# Altium schematic sheet RegisterB.SchDoc: B Register
size A4; Author: Ben Eater; DrawnBy: LittleYe233; SheetNumber: 3; SheetTotal: 6
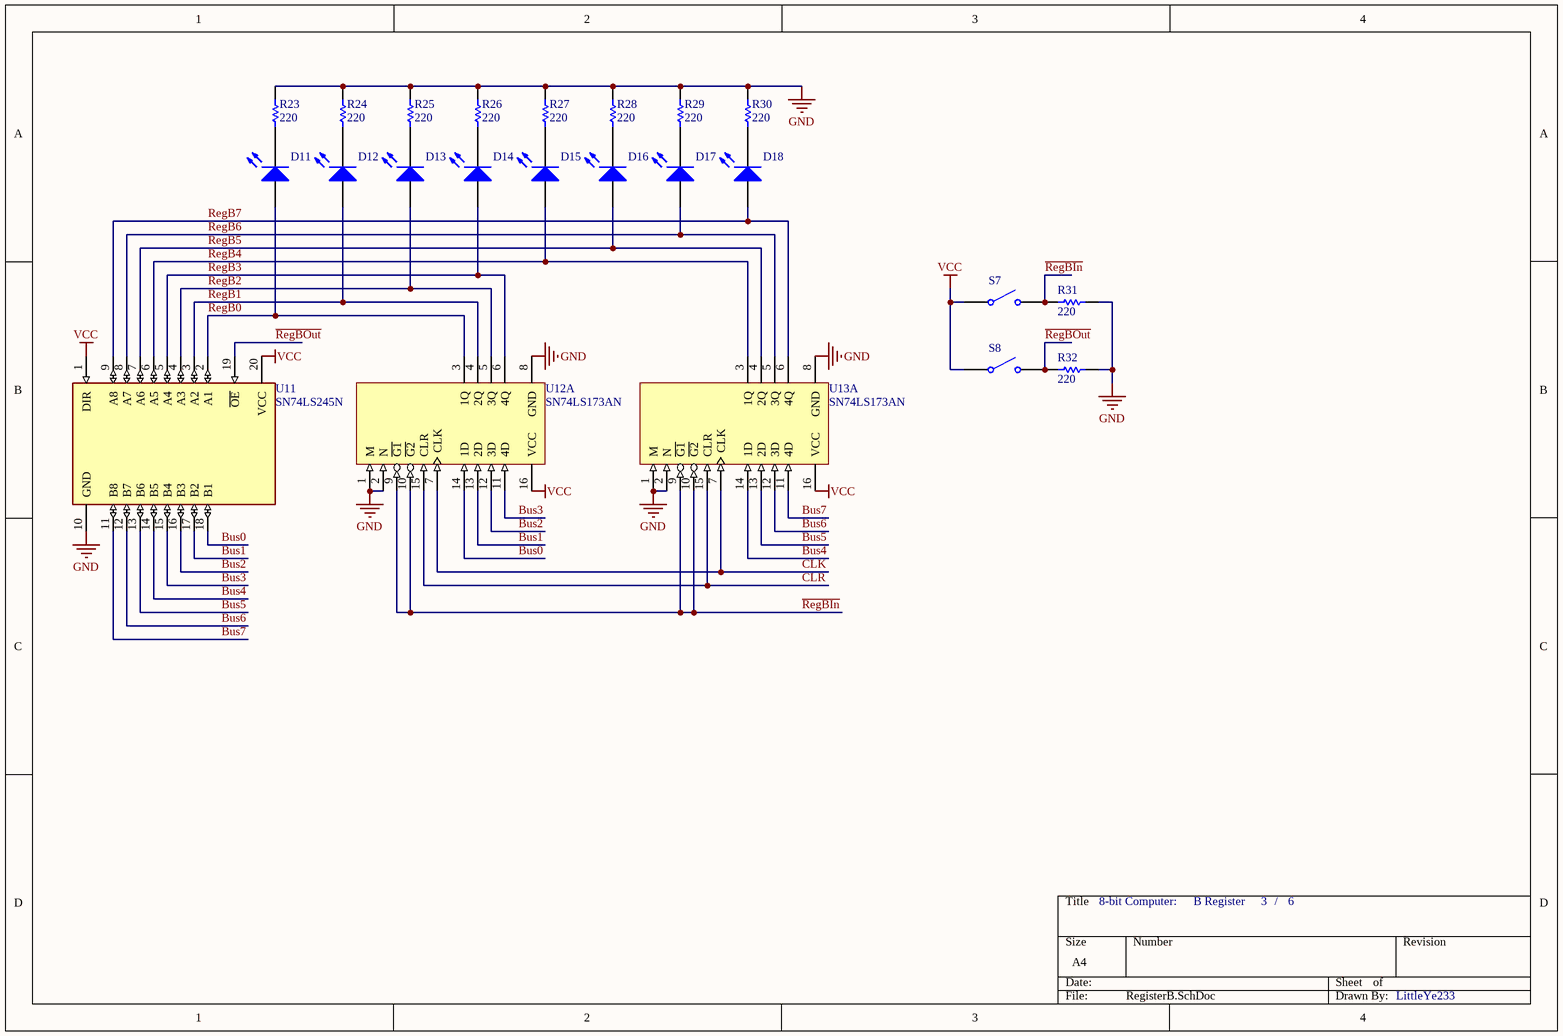
[diagram p0: RegisterB.SchDoc]

## Parts
D11  Light-Emitting Diode  (value not drawn)
D12  Light-Emitting Diode  (value not drawn)
D13  Light-Emitting Diode  (value not drawn)
D14  Light-Emitting Diode  (value not drawn)
D15  Light-Emitting Diode  (value not drawn)
D16  Light-Emitting Diode  (value not drawn)
D17  Light-Emitting Diode  (value not drawn)
D18  Light-Emitting Diode  (value not drawn)
R23  value 220  (hidden comment: Resistor)
R24  value 220  (hidden comment: Resistor)
R25  value 220  (hidden comment: Resistor)
R26  value 220  (hidden comment: Resistor)
R27  value 220  (hidden comment: Resistor)
R28  value 220  (hidden comment: Resistor)
R29  value 220  (hidden comment: Resistor)
R30  value 220  (hidden comment: Resistor)
R31  value 220  (hidden comment: Resistor)
R32  value 220  (hidden comment: Resistor)
S7  Single-Pole, Single-Throw Switch  (value not drawn)
S8  Single-Pole, Single-Throw Switch  (value not drawn)
U11  SN74LS245N  [FP-N0020A-MFG]
U12  SN74LS173AN  [N0016A]  (part A of 2)
U13  SN74LS173AN  [N0016A]  (part A of 2)

## Nets
GND: R23.2 R24.2 R25.2 R26.2 R27.2 R28.2 R29.2 R30.2 R31.1 R32.1 U11.10(GND) U12.1(M) U12.2(N) U12.8(GND) U13.1(M) U13.2(N) U13.8(GND)
VCC: S7.1 S8.1 U11.1(DIR) U11.20(VCC) U12.16(VCC) U13.16(VCC)
Bus0: U11.18(B1) U12.14(1D)
Bus1: U11.17(B2) U12.13(2D)
Bus2: U11.16(B3) U12.12(3D)
Bus3: U11.15(B4) U12.11(4D)
Bus4: U11.14(B5) U13.14(1D)
Bus5: U11.13(B6) U13.13(2D)
Bus6: U11.12(B7) U13.12(3D)
Bus7: U11.11(B8) U13.11(4D)
CLK: U12.7(CLK) U13.7(CLK)
CLR: U12.15(CLR) U13.15(CLR)
~{RegBIn}: R31.2 S7.2 U12.9(~{G1}) U12.10(~{G2}) U13.9(~{G1}) U13.10(~{G2})
~{RegBOut}: R32.2 S8.2 U11.19(~{OE})
RegB0: D11.1(A) U11.2(A1) U12.3(1Q)
RegB1: D12.1(A) U11.3(A2) U12.4(2Q)
RegB2: D13.1(A) U11.4(A3) U12.5(3Q)
RegB3: D14.1(A) U11.5(A4) U12.6(4Q)
RegB4: D15.1(A) U11.6(A5) U13.3(1Q)
RegB5: D16.1(A) U11.7(A6) U13.4(2Q)
RegB6: D17.1(A) U11.8(A7) U13.5(3Q)
RegB7: D18.1(A) U11.9(A8) U13.6(4Q)
NetD11_2: D11.2(K) R23.1
NetD12_2: D12.2(K) R24.1
NetD13_2: D13.2(K) R25.1
NetD14_2: D14.2(K) R26.1
NetD15_2: D15.2(K) R27.1
NetD16_2: D16.2(K) R28.1
NetD17_2: D17.2(K) R29.1
NetD18_2: D18.2(K) R30.1

## Notes on the sheet
- 8-bit Computer:
- /

## Library data of the parts
D11-D18 = LED: AF: 1; BV: 0; BV_MAX: 1e99; EG: 1.11; FC: 0.5; IBV: 0.001; IS: 1e-14; MJSW: 0.33; NTUN: 30; TNOM: 27; XTI: 3; SimulationGenericComponent: True; CJO: 0; CJP: 0; CTA: 0; CTP: 0; FCS: 0.5; FV_MAX: 1e99; IKF: 0; IKR: 0; ISR: 1e-14; JSW: 0; JTUN: 0; JTUNSW: 0; KEG: 1; KF: 0; LEVEL: 1; N: 1; NBV: 1; NR: 1; NS: 1; PHP: 1; RS: 0; TCV: 0; TLEV: 0; TLEVC: 0; TM1: 0; TM2: 0; TPB: 0; TPHP: 0; TRS: 0; TRS2: 0; TT: 0; TTT1: 0; TTT2: 0; VJ: 1; XTITUN: 3
R23-R32 = Resistor: TC1: 0; SimulationGenericComponent: True; TC2: 0
S7 S8 = SPST SW: closed: 0; Rclosed: 1m; Ropen: 1Meg; SimulationGenericComponent: True
U11 = CMP-1620-00419-3: IC TXRX NON-INVERT 5.25V 20DIP; Number of Bits per Element: 8; Polarity: Non-Inverting; Low Level Output Current: 24mA; Propagation Delay: 12ns; Min Supply Voltage: 4.75V; Number of Elements: 1; Quiescent Current: 62mA; Logic Function: Transceiver; Direction: Bidirectional; Operating Supply Voltage: 5V; High Level Output Current: -15mA; Mount: Through Hole; Min Operating Temperature: 0°C; Number of Outputs: 8; Max Operating Temperature: 70°C; Max Supply Voltage: 5.25V; Width: 6.35mm; Number of Pins: 20; RoHS Compliant: Yes; Turn-On Delay Time: 12ns; Termination: Through Hole; Number of Channels: 8; Number of Circuits: 8; Weight: 0.042297oz; Package Quantity: 20; Number of Transceivers: 8; Length: 24.33mm; Height: 4.57mm; REACH SVHC: No SVHC; Contact Plating: Gold; Number of Bits: 8; Lead Free: Lead Free; Case/Package: PDIP; Packaging: Rail/Tube; Radiation Hardening: No
U12 U13 = CMP-1619-00777-2: 4-Bit D-type Registers with 3-State Outputs, N0016A, TUBE; Manufacturer: Texas Instruments; VCC(Max)(V): 5.25; ICC @ Nom Voltage(Max)(mA): 24; F @ Nom Voltage(Max)(Mhz): 35; Bits(#): 4; tpd @ Nom Voltage(Max)(ns): 30; Output Logic: Non-inverted; VCC(Min)(V): 4.75; 3-State Output: Yes; Voltage(Nom)(V): 5; Output Drive (IOL/IOH)(Max)(mA): 24/-2.6; Rating: Catalog; Output: 3S; Input Type: TTL; Technology Family: LS; Schmitt Trigger: No; Operating Temperature Range(C): 0 to 70; DatasheetVersion: SDLS067A; Generic Part Number: SN74LS173A; Output Type: TTL; PackageReference: N0016A; Code_JEDEC: MS-001